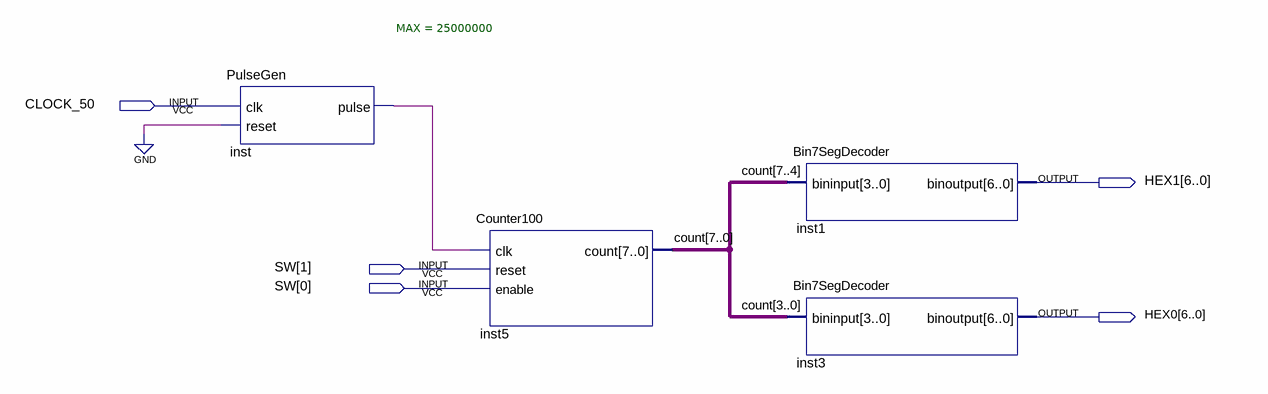
[diagram p0: schematic sheet]
// Quartus schematic MiniProjeto.bdf as structural Verilog: 4 symbols, 5 pins
module MiniProjeto (
  input  CLOCK_50,
  input  [1:0] SW,
  output [6:0] HEX1,
  output [6:0] HEX0
);

  wire inst_pulse;
  wire [7:0] count;

  PulseGen #(.MAX(25000000)) inst (.clk(CLOCK_50), .reset(1'b0), .pulse(inst_pulse));
  Counter100 inst5 (.clk(inst_pulse), .reset(SW[1]), .enable(SW[0]), .count(count));
  Bin7SegDecoder inst1 (.bininput(count[7:4]), .binoutput(HEX1));
  Bin7SegDecoder inst3 (.bininput(count[3:0]), .binoutput(HEX0));
endmodule
